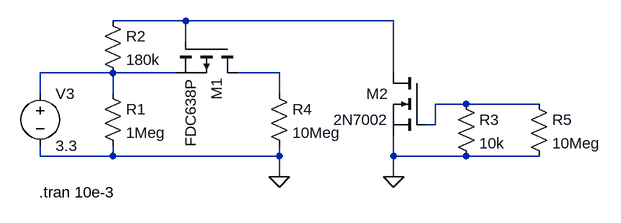
[diagram p0: schematic FTDI_Switch_PowerTest.asc]
FTDI_Switch_PowerTest.asc, the LTspice schematic file:
Version 4
SHEET 1 880 680
WIRE 192 -32 80 -32
WIRE 512 -32 192 -32
WIRE 192 0 192 -32
WIRE 80 48 -32 48
WIRE 176 48 80 48
WIRE 336 48 272 48
WIRE 512 48 512 -32
WIRE -32 80 -32 48
WIRE 80 80 80 48
WIRE 336 80 336 48
WIRE 624 96 576 96
WIRE 736 96 624 96
WIRE 576 128 576 96
WIRE 576 128 560 128
WIRE -32 176 -32 160
WIRE 80 176 80 160
WIRE 80 176 -32 176
WIRE 336 176 336 160
WIRE 336 176 80 176
WIRE 512 176 512 144
WIRE 624 176 512 176
WIRE 736 176 624 176
WIRE 336 208 336 176
WIRE 512 208 512 176
FLAG 336 208 0
FLAG 512 208 0
SYMBOL pmos 272 0 R90
SYMATTR InstName M1
SYMATTR Value FDC638P
SYMBOL res 64 64 R0
SYMATTR InstName R1
SYMATTR Value 1Meg
SYMBOL res 64 -48 R0
SYMATTR InstName R2
SYMATTR Value 180k
SYMBOL nmos 560 48 M0
SYMATTR InstName M2
SYMATTR Value 2N7002
SYMBOL res 608 80 R0
SYMATTR InstName R3
SYMATTR Value 10k
SYMBOL voltage -32 64 R0
WINDOW 123 0 0 Left 2
WINDOW 39 0 0 Left 2
SYMATTR InstName V3
SYMATTR Value 3.3
SYMBOL res 320 64 R0
SYMATTR InstName R4
SYMATTR Value 10Meg
SYMBOL res 720 80 R0
SYMATTR InstName R5
SYMATTR Value 10Meg
TEXT -34 232 Left 2 !.tran 10e-3

The netlist it stands for:
* FTDI_Switch_PowerTest.asc
M1 N003 N001 N002 N002 FDC638P
R1 N002 0 1Meg
R2 N001 N002 180k
M2 N001 N004 0 0 2N7002
R3 N004 0 10k
V3 N002 0 3.3
R4 N003 0 10Meg
R5 N004 0 10Meg
.model NMOS NMOS
.model PMOS PMOS
.lib standard.mos
.tran 10e-3
.backanno
.end